# Altium project PCB_Project.PrjPcb
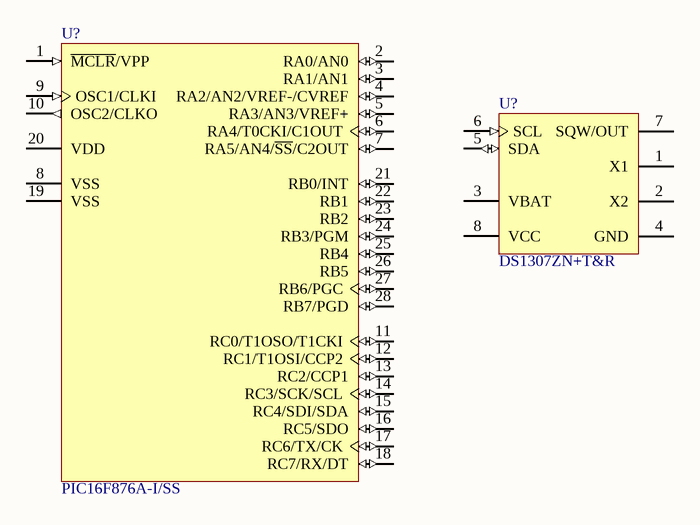
[diagram p0: Sheet2.SchDoc]
1 sheet, 2 parts. Net scope: global (net labels, ports and power ports of the same name join across sheets).
Board file: PCB1.PcbDoc

## Sheet Sheet2.SchDoc
size A4

### Parts
U1  PIC16F876A-I/SS  [SSOP-SS28_L]
U2  DS1307ZN+T&R  [S8+2_N]

### Nets

Not connected (* = marked no-connect by the designer): U1 1(~{MCLR}/VPP) 2(RA0/AN0) 3(RA1/AN1) 4(RA2/AN2/VREF-/CVREF) 5(RA3/AN3/VREF+) 6(RA4/T0CKI/C1OUT) 7(RA5/AN4/~{SS}/C2OUT) 8(VSS) 9(OSC1/CLKI) 10(OSC2/CLKO) 11(RC0/T1OSO/T1CKI) 12(RC1/T1OSI/CCP2) 13(RC2/CCP1) 14(RC3/SCK/SCL) 15(RC4/SDI/SDA) 16(RC5/SDO) 17(RC6/TX/CK) 18(RC7/RX/DT) 19(VSS) 20(VDD) 21(RB0/INT) 22(RB1) 23(RB2) 24(RB3/PGM) 25(RB4) 26(RB5) 27(RB6/PGC) 28(RB7/PGD); U2 1(X1) 2(X2) 3(VBAT) 4(GND) 5(SDA) 6(SCL) 7(SQW/OUT) 8(VCC)

### Library data of the parts
U1 = CMP-0115-01331-1: Enhanced FLASH Microcontroller, 8K (x14-Bit words) FLASH, 368 Bytes RAM, 28-Pin SSOP, Standard VDD Range, Industrial Temperature; ComponentAvailability: Unknown. Contact manufacturer to determine status.; Code_JEDEC: MS-150; PackageDescription: 28-Lead Plastic Shrink Small Outline (SS) - 5.3mm Body [SSOP]; PackageVersion: revBB, Aug-2009; PackageReference: SSOP-SS28; DatasheetVersion: revB, Oct-2003
U2 = CMP-0254-00344-1: 64 x 8, Serial, I2C Real-Time Clock, 5.0V, 8-Pin SO, -40 to 85 degC, Pb-Free, Reel; ComponentLink2Description: Datasheet; ComponentLink2URL: http://datasheets.maxim-ic.com/en/ds/DS1307.pdf; PackageVersion: revC, 2010; PackageDescription: 8-Pin Small-Outline IC, Narrow (0.15in), 1.27 mm Pitch, SOIC (N), Pb-Free; ComponentLink3URL: http://pdfserv.maxim-ic.com/package_dwgs/21-0041.PDF; PackageReference: S8+2; ComponentLink3Description: Package Specification; DatasheetVersion: 10-Feb-2008; Code_IPC: SOIC127P600-8; ComponentLink1Description: Manufacturer URL; Code_JEDEC: MS-012-AA; ComponentLink1URL: http://www.maxim-ic.com